# EAGLE design flipper-coleco (EAGLE 6.5.0)
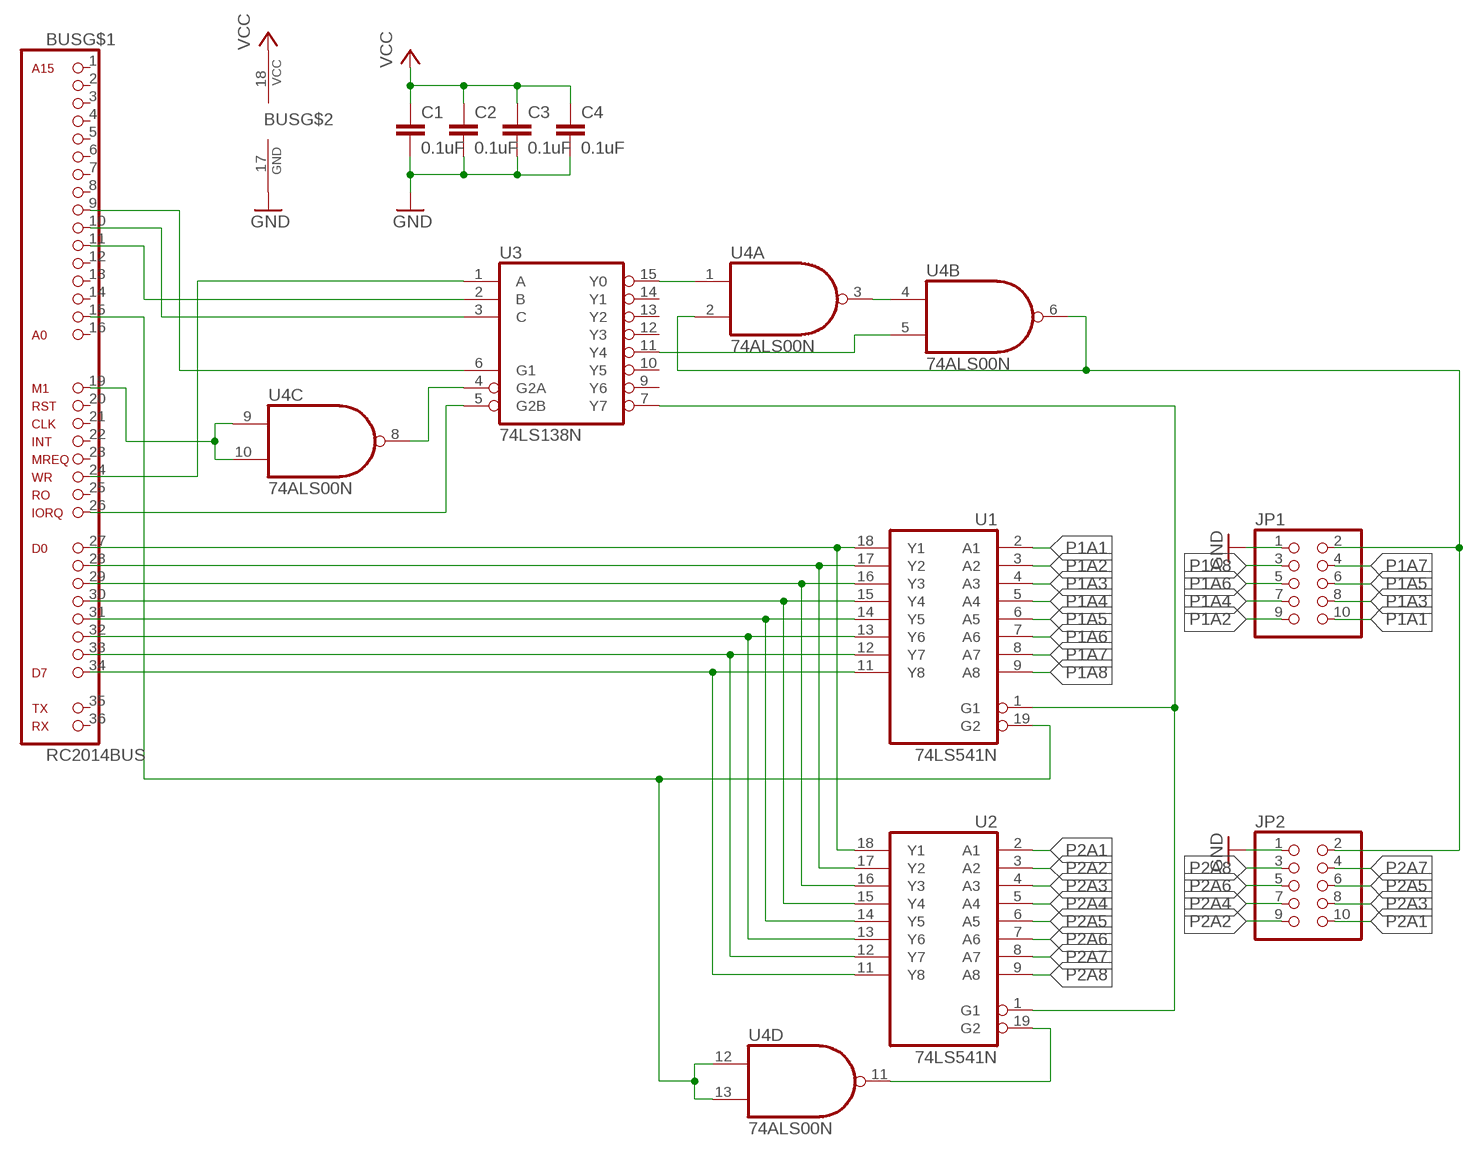
[diagram p0: schematic, sheet 1]

## Parts
BUS  RC2014BUS  [1X39]
C1  0.1uF  C-EU050-024X044  [C050-024X044]
C2  0.1uF  C-EU050-024X044  [C050-024X044]
C3  0.1uF  C-EU050-024X044  [C050-024X044]
C4  0.1uF  C-EU050-024X044  [C050-024X044]
JP1  PINHD-2X5  [2X05]
JP2  PINHD-2X5  [2X05]
U1  74LS541N  [DIL20]
U2  74LS541N  [DIL20]
U3  74LS138N  [DIL16]
U4  74ALS00N  [DIL14]

## Nets
A1: BUS.15(A1) U1.19(G2) U4.12(D:I0) U4.13(D:I1)
GND: BUS.17(GND) C1.2 C2.2 C3.2 C4.2 JP1.1 JP2.1
N$1: BUS.34(D7) U1.11(Y8) U2.11(Y8)
N$2: BUS.33(D6) U1.12(Y7) U2.12(Y7)
N$3: BUS.32(D5) U1.13(Y6) U2.13(Y6)
N$4: BUS.31(D4) U1.14(Y5) U2.14(Y5)
N$5: BUS.30(D3) U1.15(Y4) U2.15(Y4)
N$6: BUS.29(D2) U1.16(Y3) U2.16(Y3)
N$7: BUS.28(D1) U1.17(Y2) U2.17(Y2)
N$8: BUS.27(D0) U1.18(Y1) U2.18(Y1)
N$9: BUS.24(WR) U3.1(A)
N$10: BUS.11(A5) U3.2(B)
N$11: BUS.10(A6) U3.3(C)
N$12: BUS.9(A7) U3.6(G1)
N$13: BUS.26(IORQ) U3.5(G2B)
N$14: U3.4(G2A) U4.8(C:O)
N$15: BUS.19(M1) U4.9(C:I0) U4.10(C:I1)
N$17: U1.1(G1) U2.1(G1) U3.7(Y7)
N$19: U4.3(A:O) U4.4(B:I0)
N$20: U3.15(Y0) U4.1(A:I0)
N$21: U3.11(Y4) U4.5(B:I1)
N$22: JP1.2 JP2.2 U4.2(A:I1) U4.6(B:O)
N$38: U2.19(G2) U4.11(D:O)
P1A1: JP1.10 U1.2(A1)
P1A2: JP1.9 U1.3(A2)
P1A3: JP1.8 U1.4(A3)
P1A4: JP1.7 U1.5(A4)
P1A5: JP1.6 U1.6(A5)
P1A6: JP1.5 U1.7(A6)
P1A7: JP1.4 U1.8(A7)
P1A8: JP1.3 U1.9(A8)
P2A1: JP2.10 U2.2(A1)
P2A2: JP2.9 U2.3(A2)
P2A3: JP2.8 U2.4(A3)
P2A4: JP2.7 U2.5(A4)
P2A5: JP2.6 U2.6(A5)
P2A6: JP2.5 U2.7(A6)
P2A7: JP2.4 U2.8(A7)
P2A8: JP2.3 U2.9(A8)
VCC: BUS.18(VCC) C1.1 C2.1 C3.1 C4.1
Unconnected: BUS.1(A15) BUS.2(A14) BUS.3(A13) BUS.4(A12) BUS.5(A11) BUS.6(A10) BUS.7(A9) BUS.8(A8) BUS.12(A4) BUS.13(A3) BUS.14(A2) BUS.16(A0) BUS.20(RST) BUS.21(CLK) BUS.22(INT) BUS.23(MREQ) BUS.25(RO) BUS.35(TX) BUS.36(RX) U3.9(Y6) U3.10(Y5) U3.12(Y3) U3.13(Y2) U3.14(Y1)

## Power pins joined to a net without a drawn wire
GND: U1.10(GND) U2.10(GND) U3.8(GND) U4.7(P:GND)
VCC: U1.20(VCC) U2.20(VCC) U3.16(VCC) U4.14(P:VCC)

## Library data of the parts
BUS = logick:RC2014BUS
C1-C4 = rcl:C-EU: CAPACITOR, European symbol
JP1 JP2 = pinhead:PINHD-2X5: PIN HEADER
U1 U2 = 74xx-us:74*541: Octal BUFFER and LINE DRIVER, 3-state
U3 = 74xx-us:74*138: 3-line to 8-line DECODER/DEMULTIPLEXER
U4 = 74xx-us:74*00: Quad 2-input NAND gate

## Board
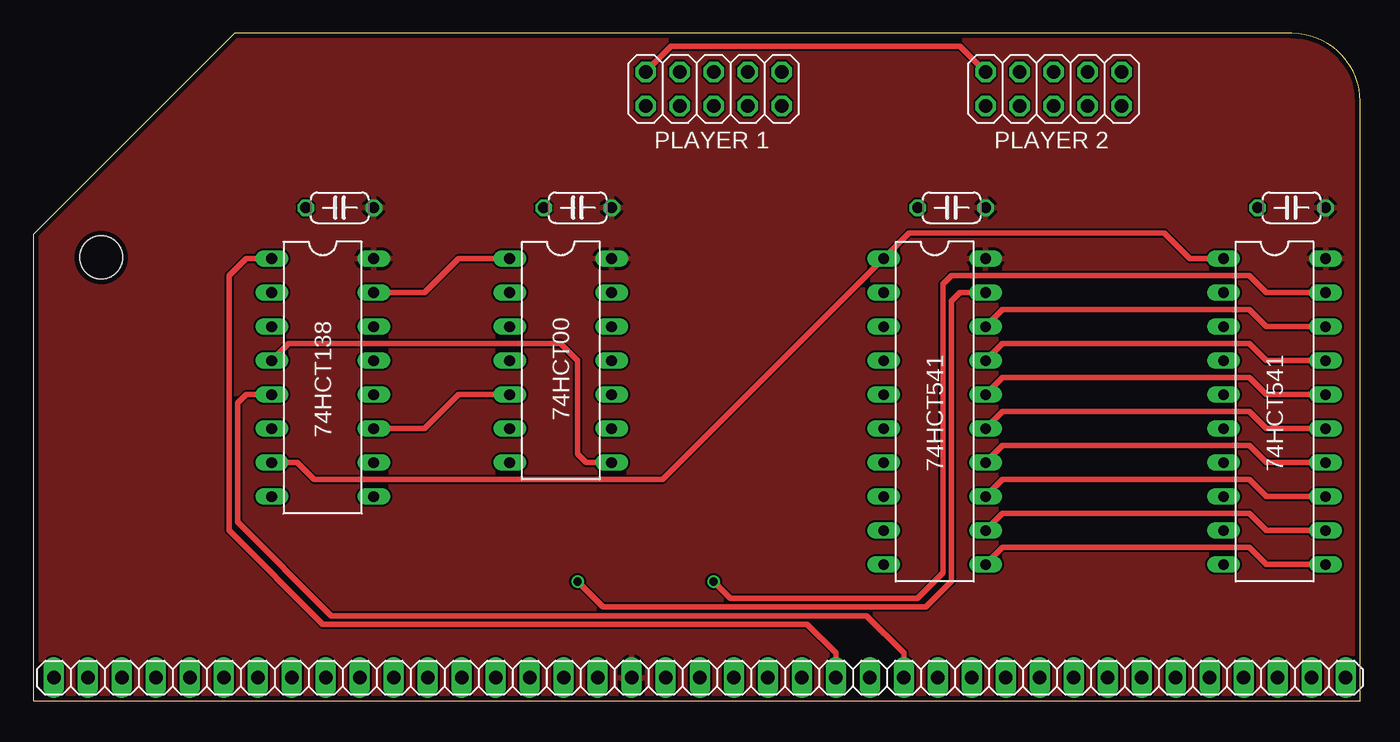
[diagram p1: board, top side]
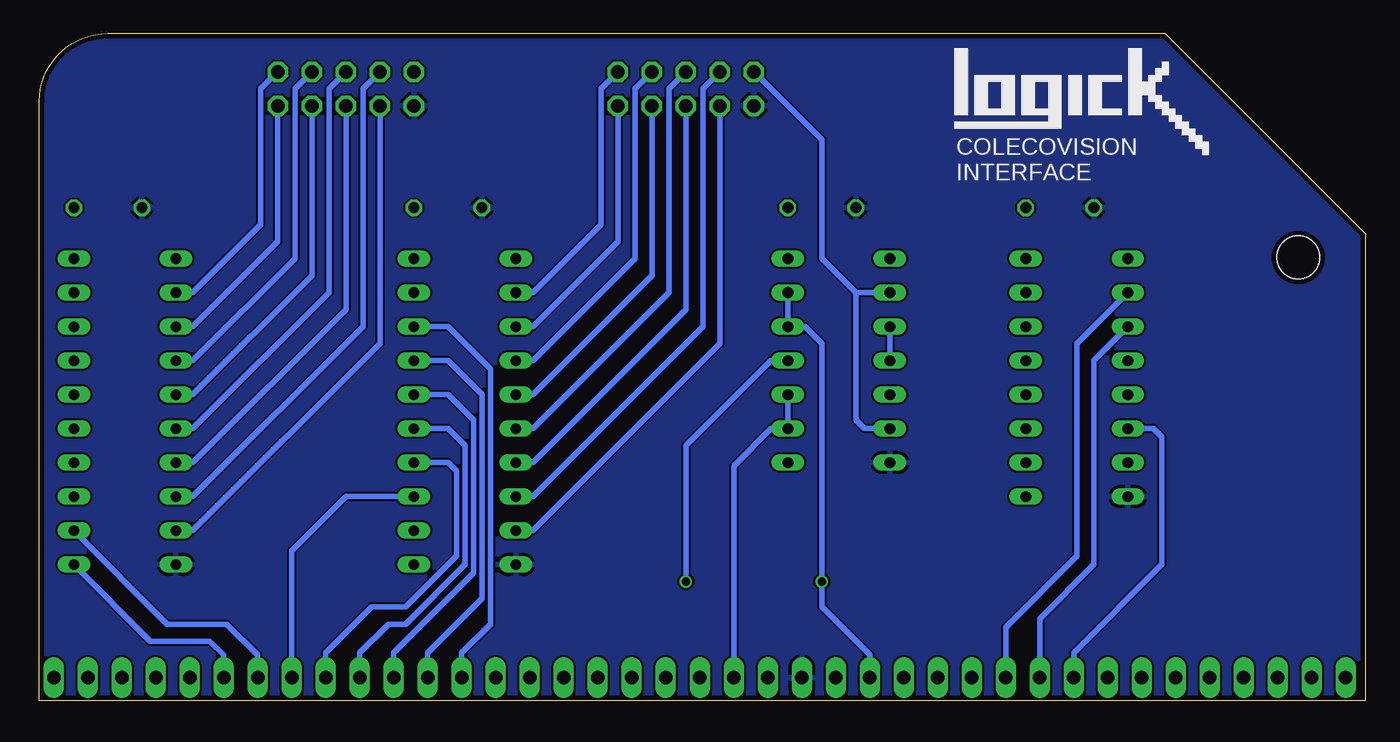
[diagram p2: board, bottom side, seen from below]

Size 99.11 x 49.86 mm. Coordinates in mm from the lower left corner, seen from the top.
Outline: 0,0 99.11,0 99.11,44.76 arc90 94.01,49.86 15.01,49.86 0,34.85 0,0
Copper layers (1*16): Top 0.0356mm / dielectric 1.5011mm / Bottom 0.0356mm
Design rules "oshpark-2layer": minimum track width 6mil, minimum drill 13mil, track to track 6mil, track to pad 6mil, pad to pad 6mil, via to via 6mil, smd to smd 6mil, copper to edge 15mil, drill to drill 6mil, minimum pad ring 7mil, minimum via ring 7mil, stop-mask expansion 2.5mil, vias tented up to drill 0mil, thermal gap 10mil
Holes 3.2 mm at 5.03,33.12

### Footprints (pad centres in the part's own frame; a part is rotated, then mirrored left to right if it is on the bottom)
1X39 = drill 1.016 long: 1 0,0; 2 2.54,0; 3 5.08,0; 4 7.62,0; 5 10.16,0; 6 12.7,0; 7 15.24,0; 8 17.78,0; 9 20.32,0; 10 22.86,0; 11 25.4,0; 12 27.94,0; 13 30.48,0; 14 33.02,0; 15 35.56,0; 16 38.1,0; 17 40.64,0; 18 43.18,0; 19 45.72,0; 20 48.26,0; 21 50.8,0; 22 53.34,0; 23 55.88,0; 24 58.42,0; 25 60.96,0; 26 63.5,0; 27 66.04,0; 28 68.58,0; 29 71.12,0; 30 73.66,0; 31 76.2,0; 32 78.74,0; 33 81.28,0; 34 83.82,0; 35 86.36,0; 36 88.9,0; 37 91.44,0; 38 93.98,0; 39 96.52,0
C050-024X044 = drill 0.813 octagon: 1 -2.54,0; 2 2.54,0
2X05 = drill 1.016 octagon: 1 -5.08,-1.27; 2 -5.08,1.27; 3 -2.54,-1.27; 4 -2.54,1.27; 5 0,-1.27; 6 0,1.27; 7 2.54,-1.27; 8 2.54,1.27; 9 5.08,-1.27; 10 5.08,1.27
DIL20 = drill 0.813 long: 1 -11.43,-3.81; 2 -8.89,-3.81; 3 -6.35,-3.81; 4 -3.81,-3.81; 5 -1.27,-3.81; 6 1.27,-3.81; 7 3.81,-3.81; 8 6.35,-3.81; 9 8.89,-3.81; 10 11.43,-3.81; 11 11.43,3.81; 12 8.89,3.81; 13 6.35,3.81; 14 3.81,3.81; 15 1.27,3.81; 16 -1.27,3.81; 17 -3.81,3.81; 18 -6.35,3.81; 19 -8.89,3.81; 20 -11.43,3.81
DIL16 = drill 0.813 long: 1 -8.89,-3.81; 2 -6.35,-3.81; 3 -3.81,-3.81; 4 -1.27,-3.81; 5 1.27,-3.81; 6 3.81,-3.81; 7 6.35,-3.81; 8 8.89,-3.81; 9 8.89,3.81; 10 6.35,3.81; 11 3.81,3.81; 12 1.27,3.81; 13 -1.27,3.81; 14 -3.81,3.81; 15 -6.35,3.81; 16 -8.89,3.81
DIL14 = drill 0.813 long: 1 -7.62,-3.81; 2 -5.08,-3.81; 3 -2.54,-3.81; 4 0,-3.81; 5 2.54,-3.81; 6 5.08,-3.81; 7 7.62,-3.81; 8 7.62,3.81; 9 5.08,3.81; 10 2.54,3.81; 11 0,3.81; 12 -2.54,3.81; 13 -5.08,3.81; 14 -7.62,3.81

### Placement (x,y rotation side)
BUS  1.5,1.72 0 top
C1  68.58,36.83 180 top
C2  93.98,36.83 180 top
C3  22.86,36.83 180 top
C4  40.64,36.83 180 top
JP1  50.8,45.72 0 top
JP2  76.2,45.72 0 top
U1  67.31,21.59 270 top
U2  92.71,21.59 270 top
U3  21.59,24.13 270 top
U4  39.37,25.4 270 top

### Tracks (layer width: path | path; a pad name or v marks a point on that pad's centre or on a via)
A1  (via drill 0.6)
  Top 0.406: U1.19 69.22,30.48 68.58,29.84 68.58,8.89 66.67,6.99 42.55,6.99 v40.64,8.89
  Bottom 0.406: U4.13 U4.12 41.91,27.94 40.64,26.67 v40.64,8.89 40.64,6.99 37.06,3.4 BUS.15
GND
  pour Bottom: 100,-1 -1,-1 -1,51 100,51
N$1
  Top 0.406: U2.11 92.08,10.16 90.81,11.43 72.39,11.43 U1.11
  Bottom 0.406: BUS.34 85.32,3.4 86.36,4.45 90.81,4.45 U2.11
N$2
  Top 0.406: U1.12 72.39,13.97 90.81,13.97 92.08,12.7 U2.12
  Bottom 0.406: BUS.33 82.78,3.4 85.09,5.71 89.53,5.71 U2.12
N$3
  Top 0.406: U2.13 92.08,15.24 90.81,16.51 72.39,16.51 U1.13
  Bottom 0.406: U1.13 76.2,15.24 80.24,11.2 BUS.32
N$4
  Top 0.406: U2.14 92.08,17.78 90.81,19.05 72.39,19.05 U1.14
  Bottom 0.406: U1.14 68.58,17.78 67.94,17.14 67.94,10.79 71.75,6.99 74.3,6.99 77.7,3.58 BUS.31
N$5
  Top 0.406: U2.15 92.08,20.32 90.81,21.59 72.39,21.59 U1.15
  Bottom 0.406: U1.15 68.58,20.32 67.31,19.05 67.31,10.16 71.75,5.71 73.03,5.71 75.16,3.58 BUS.30
N$6
  Top 0.406: U2.16 92.08,22.86 90.81,24.13 72.39,24.13 U1.16
  Bottom 0.406: U1.16 68.58,22.86 66.67,20.95 66.67,9.53 72.62,3.58 BUS.29
N$7
  Top 0.406: U2.17 92.08,25.4 90.81,26.67 72.39,26.67 U1.17
  Bottom 0.406: U1.17 68.58,25.4 66.04,22.86 66.04,7.62 70.08,3.58 BUS.28
N$8
  Top 0.406: U2.18 92.08,27.94 90.81,29.21 72.39,29.21 U1.18
  Bottom 0.406: U1.18 68.58,27.94 65.41,24.77 65.41,5.71 67.54,3.58 BUS.27
N$9
  Top 0.406: BUS.24 59.92,3.58 57.78,5.71 21.59,5.71 14.61,12.7 14.61,31.75 15.88,33.02 U3.1
N$10
  Bottom 0.406: BUS.11 26.9,5.49 21.59,10.79 21.59,26.67 U3.2
N$11
  Bottom 0.406: BUS.10 24.36,6.12 20.32,10.16 20.32,25.4 U3.3
N$12
  Bottom 0.406: U3.6 15.88,20.32 15.24,19.68 15.24,10.16 21.82,3.58 BUS.9
N$13
  Top 0.406: BUS.26 65,3.58 62.23,6.35 22.23,6.35 15.24,13.34 15.24,22.23 15.88,22.86 U3.5
N$14
  Top 0.406: U3.4 19.05,26.67 39.37,26.67 40.64,25.4 40.64,18.41 41.27,17.78 U4.8
N$15
  Bottom 0.406: BUS.19 47.22,17.55 44.45,20.32 U4.9 U4.10
N$17
  Top 0.406: U2.1 86.36,33.02 84.45,34.92 65.41,34.92 U1.1 46.99,16.51 20.95,16.51 19.68,17.78 U3.7
N$19
  Bottom 0.406: U4.3 U4.4
N$20
  Top 0.406: U3.15 29.21,30.48 31.75,33.02 U4.1
N$21
  Top 0.406: U3.11 29.21,20.32 31.75,22.86 U4.5
N$22
  Top 0.406: JP2.2 69.22,48.9 47.62,48.9 JP1.2
  Bottom 0.406: U4.2 38.1,30.48 | 38.1,30.48 40.64,33.02 40.64,41.91 JP1.2 | U4.6 37.47,20.32 38.1,20.95 38.1,30.48
N$38  (via drill 0.6)
  Top 0.406: U2.19 92.08,30.48 90.81,31.75 68.58,31.75 67.94,31.11 67.94,9.53 66.04,7.62 52.07,7.62 v50.8,8.89
  Bottom 0.406: v50.8,8.89 50.8,19.05 44.45,25.4 U4.11
P1A1
  Bottom 0.406: U1.2 62.23,30.48 57.15,35.56 57.15,45.72 JP1.10
P1A2
  Bottom 0.406: U1.3 62.23,27.94 55.88,34.29 JP1.9
P1A3
  Bottom 0.406: U1.4 62.23,25.4 54.61,33.02 54.61,45.72 JP1.8
P1A4
  Bottom 0.406: U1.5 62.23,22.86 53.34,31.75 JP1.7
P1A5
  Bottom 0.406: U1.6 62.23,20.32 52.07,30.48 52.07,45.72 JP1.6
P1A6
  Bottom 0.406: U1.7 62.23,17.78 50.8,29.21 JP1.5
P1A7
  Bottom 0.406: U1.8 62.23,15.24 49.53,27.94 49.53,45.72 JP1.4
P1A8
  Bottom 0.406: U1.9 62.23,12.7 48.26,26.67 JP1.3
P2A1
  Bottom 0.406: U2.2 87.63,30.48 82.55,35.56 82.55,45.72 JP2.10
P2A2
  Bottom 0.406: U2.3 87.63,27.94 81.28,34.29 JP2.9
P2A3
  Bottom 0.406: U2.4 87.63,25.4 80.01,33.02 80.01,45.72 JP2.8
P2A4
  Bottom 0.406: U2.5 87.63,22.86 78.74,31.75 JP2.7
P2A5
  Bottom 0.406: U2.6 87.63,20.32 77.47,30.48 77.47,45.72 JP2.6
P2A6
  Bottom 0.406: U2.7 87.63,17.78 76.2,29.21 JP2.5
P2A7
  Bottom 0.406: U2.8 87.63,15.24 74.93,27.94 74.93,45.72 JP2.4
P2A8
  Bottom 0.406: U2.9 87.63,12.7 73.66,26.67 JP2.3
VCC
  pour Top: 100,-1 -1,-1 -1,51 100,51

### Text on the board
tPlace: PLAYER 1 | PLAYER 2 | 74HCT00 | 74HCT138 | 74HCT541 | 74HCT541
bPlace: COLECOVISION / INTERFACE